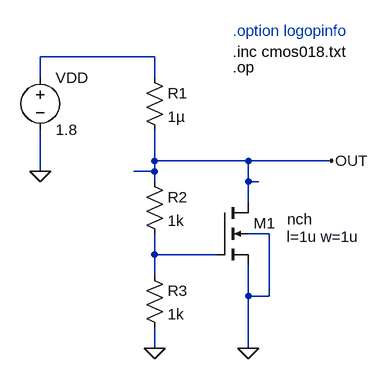
[diagram p0: schematic 2_UREF.asc]
2_UREF.asc, the LTspice schematic file:
Version 4.1
SHEET 1 1160 952
WIRE -80 112 -256 112
WIRE -256 144 -256 112
WIRE -80 144 -80 112
WIRE -80 272 -80 224
WIRE 64 272 -80 272
WIRE 192 272 64 272
WIRE -256 288 -256 224
WIRE -80 288 -80 272
WIRE -80 288 -112 288
WIRE -80 304 -80 288
WIRE 64 304 64 272
WIRE 80 304 64 304
WIRE 64 336 64 304
WIRE 96 384 64 384
WIRE -80 416 -80 384
WIRE 16 416 -80 416
WIRE -80 448 -80 416
WIRE 64 480 64 432
WIRE 96 480 96 384
WIRE 96 480 64 480
WIRE -80 560 -80 528
WIRE 64 560 64 480
FLAG -256 288 0
FLAG 64 560 0
FLAG -80 560 0
FLAG 192 272 OUT
DATAFLAG 96 272 "round($*100)/100"
DATAFLAG -80 112 "round(I(R1)*10e6)/10e6"
DATAFLAG -112 288 "round(I(R2)*10e6)/10e6"
DATAFLAG 80 304 "round(Id(M1)*10e6)/10e6"
DATAFLAG -32 416 "round($*100)/100"
SYMBOL nmos4 16 336 R0
WINDOW 123 107 53 Left 2
WINDOW 3 108 26 Left 2
SYMATTR Value2 l=1u w=1u
SYMATTR Value nch
SYMATTR InstName M1
SYMBOL voltage -256 128 R0
SYMATTR InstName VDD
SYMATTR Value 1.8
SYMBOL res -96 128 R0
SYMATTR InstName R1
SYMATTR Value 1µ
SYMBOL res -96 288 R0
SYMATTR InstName R2
SYMATTR Value 1k
SYMBOL res -96 432 R0
SYMATTR InstName R3
SYMATTR Value 1k
TEXT 40 104 Left 2 !.inc cmos018.txt
TEXT 40 128 Left 2 !.op
TEXT 40 72 Left 2 ;.option logopinfo

The netlist it stands for:
* 2_UREF.asc
M1 OUT N002 0 0 nch l=1u w=1u
VDD N001 0 1.8
R1 N001 OUT 1µ
R2 OUT N002 1k
R3 N002 0 1k
.model NMOS NMOS
.model PMOS PMOS
.lib standard.mos
.inc cmos018.txt
.op
* .option logopinfo
.backanno
.end